# EAGLE design ir sensor (EAGLE 9.6.2)
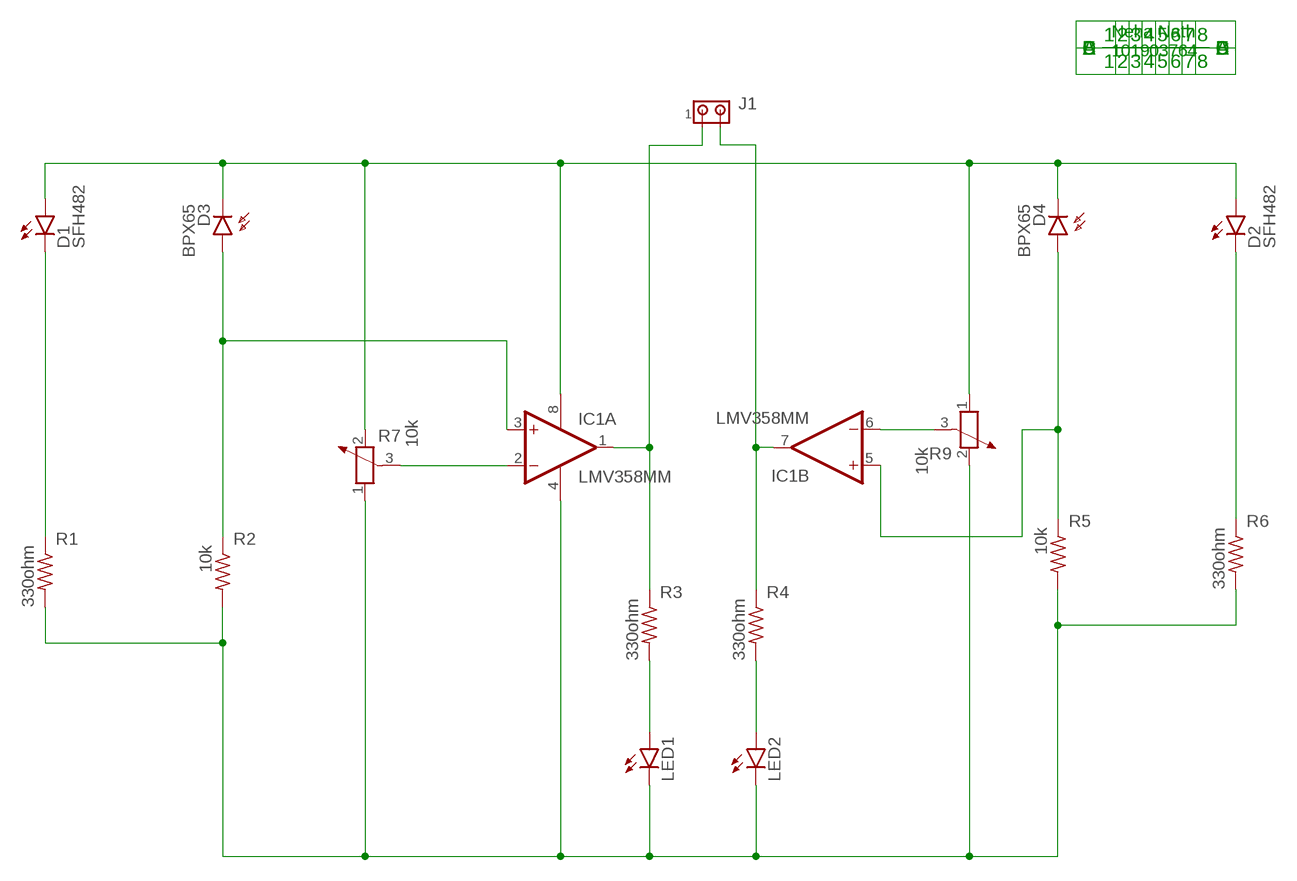
[diagram p0: schematic, sheet 1]

## Parts
D1  SFH482  [SFH482]
D2  SFH482  [SFH482]
D3  BPX65  [BPX65]
D4  BPX65  [BPX65]
IC1  LMV358MM  [MSOP08]
J1  MTA02-100  [10X02MTA]
LED1  LED3MM  [LED3MM]
LED2  LED3MM  [LED3MM]
R1  330ohm  R-US_0207/10  [0207/10]
R2  10k  R-US_0207/10  [0207/10]
R3  330ohm  R-US_0207/10  [0207/10]
R4  330ohm  R-US_0207/10  [0207/10]
R5  10k  R-US_0207/10  [0207/10]
R6  330ohm  R-US_0207/10  [0207/10]
R7  10k  POTENTIOMETER_PT-10S  [PT-10S]
R9  10k  POTENTIOMETER_PT-10S  [PT-10S]

## Nets
N$1: D1.A D2.A D3.K(C) D4.K(C) IC1.8(P:V+) R7.2 R9.1
N$2: D1.K(C) R1.1
N$3: IC1.4(P:V-) LED1.K(C) LED2.K(C) R1.2 R2.2 R5.2 R6.2 R7.1 R9.2
N$4: D3.A IC1.3(A:+IN) R2.1
N$5: IC1.1(A:OUT) J1.1 R3.1
N$6: IC1.7(B:OUT) J1.2 R4.1
N$7: LED1.A R3.2
N$8: LED2.A R4.2
N$9: D4.A IC1.5(B:+IN) R5.1
N$10: D2.K(C) R6.1
N$12: IC1.6(B:-IN) R9.3
N$13: IC1.2(A:-IN) R7.3

## Notes on the sheet
- Neha Nath
  101903764

## Library data of the parts
D1 D2 = led:SFH482: IR LED infrared emitting diode, Infineon
D3 D4 = opto-trans-siemens:BPX65: PHOTO DIODE; MPN: BPX65.; OC_FARNELL: 327451; OC_NEWARK: 06WX2764
IC1 = linear:LMV358?*: Dual General Purpose, Low Voltage, Rail-to-Rail Output Operational Amplifiers Source: http://www.national.com/mpf/LM/LMV321.html http://www.national.com/dt/lmv_qual.pdf
J1 = con-amp:MTA02-100: AMP connector
LED1 LED2 = led:LED: LED OSRAM: - CHIPLED LG R971, LG N971, LY N971, LG Q971, LY Q971, LO R971, LY R971 LH N974, LH R974 LS Q976, LO Q976, LY Q976 LO Q996 - Hyper CHIPLED LW Q18S LB Q993, LB Q99A, LB R99A - SideLED LS A670, LO A670, LY A670, LG A670, LP A670 LB A673, LV A673, LT A673, LW A673 LH A674 LY A675 LS A676, LA A676, LO A676, LY A676, LW A676 LS A679, LY A679, LG A679 - Hyper Micro SIDELED® LS Y876, LA Y876, LO Y876, LY Y876 LT Y87S - SmartLED LW L88C, LW L88S LB L89C, LB L89S, LG L890 LS L89K, LO L89K, LY L89K LS L896, LA L896, LO L896, LY L896 - TOPLED LS T670, LO T670, LY T670, LG T670, LP T670 LSG T670, LSP T670, LSY T670, LOP T670, LYG T670 LG T671, LOG T671, LSG T671 LB T673, LV T673, LT T673, LW T673 LH T674 LS T676, LA T676, LO T676, LY T676, LB T676, LH T676, LSB T676, LW T676 LB T67C, LV T67C, LT T67C, LS T67K, LO T67K, LY T67K, LW E67C LS E67B, LA E67B, LO E67B, LY E67B, LB E67C, LV E67C, LT E67C LW T67C LS T679, LY T679, LG T679 LS T770, LO T770, LY T770, LG T770, LP T770 LB T773, LV T773, LT T773, LW T773 LH T774 LS E675, LA E675, LY E675, LS T675 LS T776, LA T776, LO T776, LY T776, LB T776 LHGB T686 LT T68C, LB T68C - Hyper Mini TOPLED® LB M676 - Mini TOPLED Santana® LG M470 LS M47K, LO M47K, LY M47K Source: http://www.osram.convergy.de LUXEON: - LUMILED® LXK2-PW12-R00, LXK2-PW12-S00, LXK2-PW14-U00, LXK2-PW14-V00 LXK2-PM12-R00, LXK2-PM12-S00, LXK2-PM14-U00 LXK2-PE12-Q00, LXK2-PE12-R00, LXK2-PE12-S00, LXK2-PE14-T00, LXK2-PE14-U00 LXK2-PB12-K00, LXK2-PB12-L00, LXK2-PB12-M00, LXK2-PB14-N00, LXK2-PB14-P00, LXK2-PB14-Q00 LXK2-PR12-L00, LXK2-PR12-M00, LXK2-PR14-Q00, LXK2-PR14-R00 LXK2-PD12-Q00, LXK2-PD12-R00, LXK2-PD12-S00 LXK2-PH12-R00, LXK2-PH12-S00 LXK2-PL12-P00, LXK2-PL12-Q00, LXK2-PL12-R00 Source: www.luxeon.com KINGBRIGHT: KA-3528ASYC Source: www.kingbright.com
R1-R6 = rcl:R-US_: RESISTOR, American symbol; SPICEPREFIX: R
R7 R9 = rcl:POTENTIOMETER_: Potentiometer; SPICEMODEL: POT; SPICEPREFIX: X

## Board
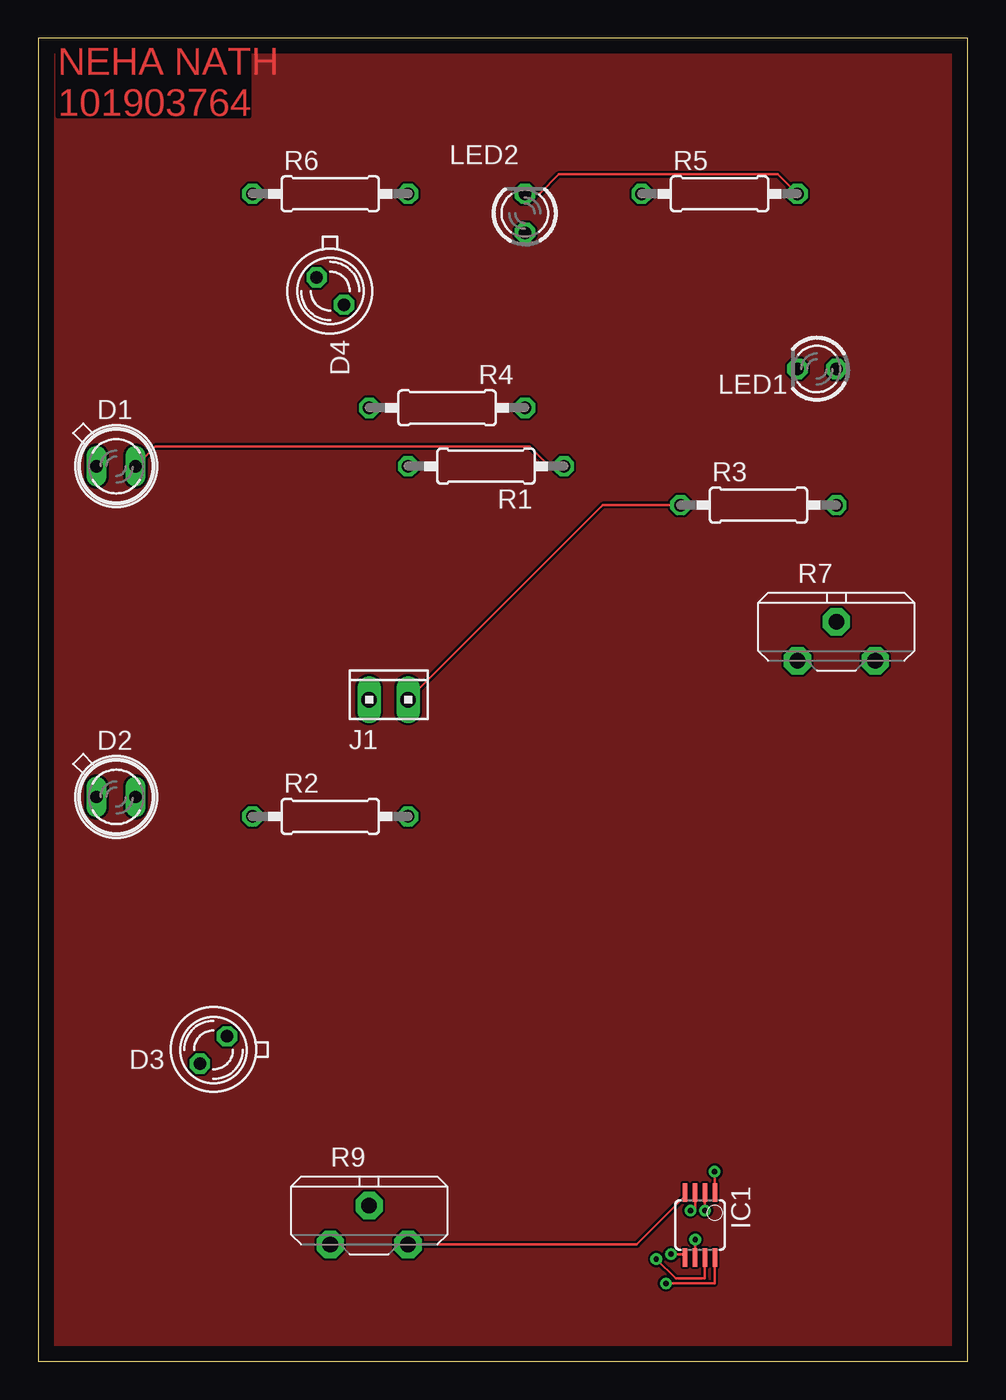
[diagram p1: board, top side]
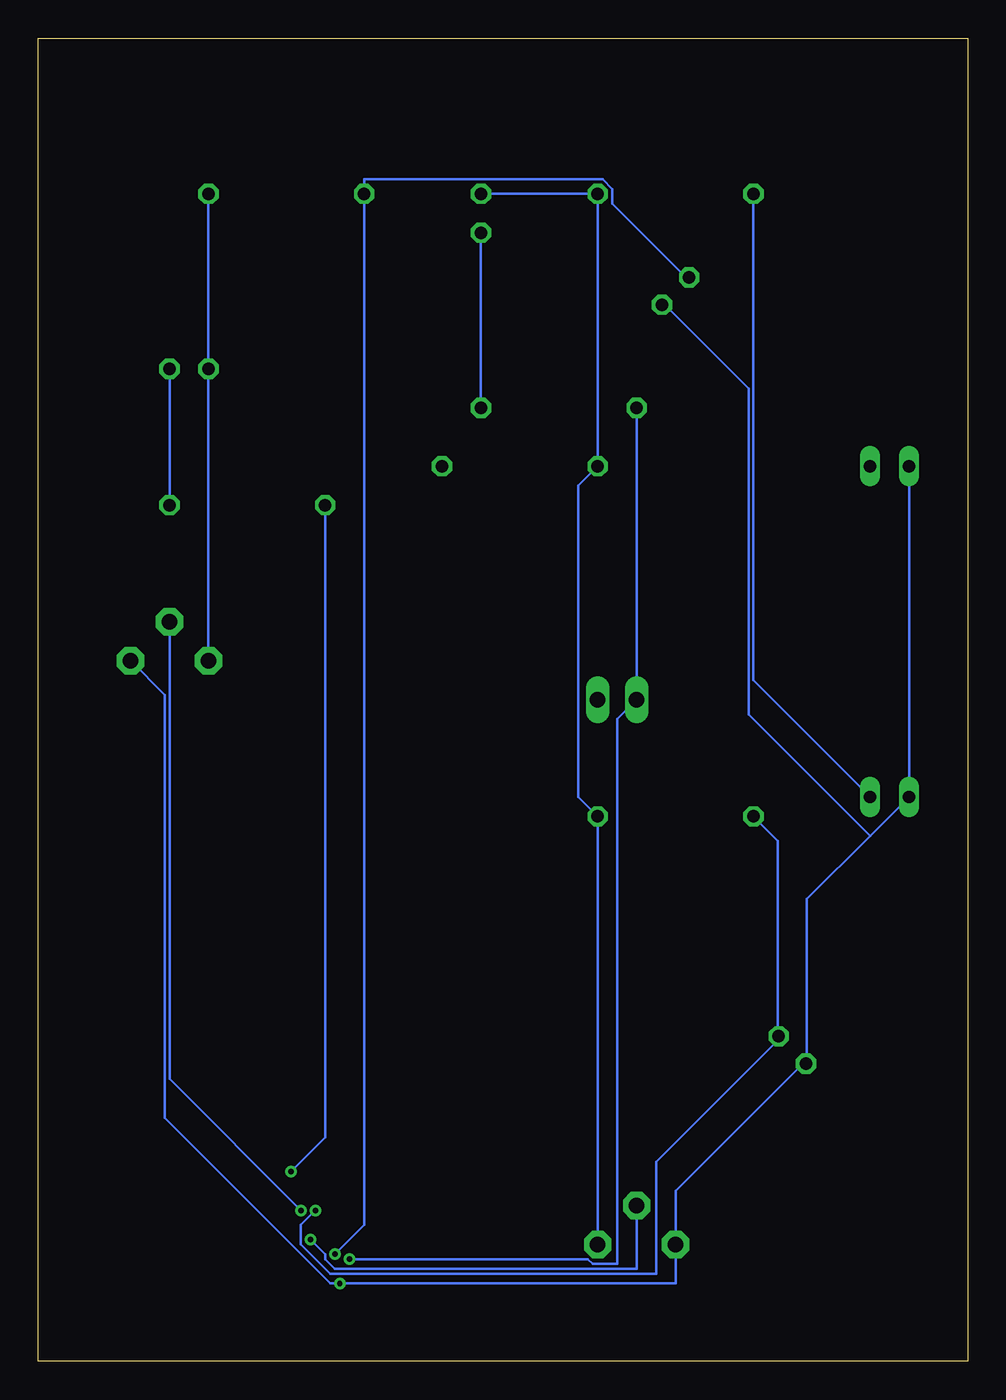
[diagram p2: board, bottom side, seen from below]

Size 60.63 x 86.35 mm. Coordinates in mm from the lower left corner, seen from the top.
Outline: 0,0 60.63,0 60.63,86.35 0,86.35 0,0
Copper layers (1*16): Top 0.035mm / dielectric 1.5mm / Bottom 0.035mm
Design rules "default": minimum track width 6mil, minimum drill 0.35mm, track to track 6mil, track to pad 6mil, pad to pad 6mil, via to via 6mil, smd to smd 6mil, copper to edge 40mil, drill to drill 6mil, minimum pad ring 10mil, minimum via ring 8mil, stop-mask expansion 4mil, vias tented up to drill 0mil, thermal gap 10mil

### Footprints (pad centres in the part's own frame; a part is rotated, then mirrored left to right if it is on the bottom)
SFH482 = drill 0.813 long: A -1.27,0; K 1.27,0
BPX65 = drill 0.813 octagon: A -0.889,-0.889; K 0.889,0.889
MSOP08 = smd 0.3 x 1.2: 1 -0.976,-2.113; 2 -0.326,-2.113; 3 0.324,-2.113; 4 0.974,-2.113; 5 0.974,2.112; 6 0.324,2.112; 7 -0.326,2.112; 8 -0.976,2.112
10X02MTA = drill 1.016 long: 1 1.27,0; 2 -1.27,0
LED3MM = drill 0.813 octagon: A -1.27,0; K 1.27,0
0207/10 = drill 0.813 octagon: 1 -5.08,0; 2 5.08,0
PT-10S = drill 1.016 pad 1.778 octagon: 1 -2.54,-1.27; 2 2.54,-1.27; 3 0,1.27

### Placement (x,y rotation side)
D1  5.08,58.42 0 top
D2  5.08,36.83 0 top
D3  11.43,20.32 180 top
D4  19.05,69.85 270 top
IC1  43.18,8.89 180 top
J1  22.86,43.18 0 top
LED1  50.8,64.77 180 top
LED2  31.75,74.93 90 top
R1  29.21,58.42 180 top
R2  19.05,35.56 0 top
R3  46.99,55.88 0 top
R4  26.67,62.23 0 top
R5  44.45,76.2 0 top
R6  19.05,76.2 0 top
R7  52.07,46.99 0 top
R9  21.59,8.89 0 top

### Tracks (layer width: path | path; a pad name or v marks a point on that pad's centre or on a via)
N$1  (via drill 0.35)
  Top 0.152: v40.96,5.08 44.13,5.08 44.13,6.67 IC1.8
  Bottom 0.152: 6.35,34.29 10.48,30.16 10.48,19.68 D3.K 10.79,19.37 19.05,11.11 R9.1 19.05,5.08 v40.96,5.08 41.59,5.08 52.39,15.88 52.39,43.5 R7.2 | 6.35,34.29 D2.A D1.A | 6.35,34.29 14.29,42.23 14.29,63.5 19.68,68.9 D4.K
N$2
  Top 0.152: D1.K 7.62,59.69 32.07,59.69 33.34,58.42 R1.1
N$3
  Top 0.152: R9.2 39.05,7.62 42.23,10.79 IC1.4 | R5.2 48.26,77.47 33.97,77.47 32.7,76.2 LED2.K
  Bottom 0.152: R5.2 LED1.K R7.1 | LED2.K R6.2 R1.2 25.4,57.15 25.4,36.83 R2.2 R9.2
N$4  (via drill 0.35)
  Top 0.152: v42.55,9.84 42.86,9.84 42.86,10.79 IC1.3
  Bottom 0.152: v42.55,9.84 43.5,8.89 43.5,7.62 41.59,5.71 20.32,5.71 20.32,13.02 12.38,20.95 D3.A 12.38,21.27 12.38,33.97 R2.1
N$5  (via drill 0.35)
  Top 0.152: v44.13,12.38 44.13,11.11 IC1.1 | J1.1 36.83,55.88 R3.1
  Bottom 0.152: v44.13,12.38 41.91,14.61 R3.1
N$6  (via drill 0.35)
  Top 0.152: v40.32,6.67 41.59,5.4 43.5,5.4 43.5,6.67 IC1.7
  Bottom 0.152: v40.32,6.67 24.77,6.67 24.45,6.35 22.86,6.35 22.86,41.91 J1.2 R4.1
N$7
  Bottom 0.152: LED1.A R3.2
N$8
  Bottom 0.152: LED2.A R4.2
N$9  (via drill 0.35)
  Top 0.152: v41.27,6.99 42.23,6.99 IC1.5
  Bottom 0.152: v41.27,6.99 39.37,8.89 R5.1 39.37,77.15 23.81,77.15 23.18,76.52 23.18,75.56 18.41,70.8 D4.A
N$10
  Bottom 0.152: D2.K 13.97,44.45 R6.1
N$11
  pour Top: 0,86.36 60.96,86.36 60.96,0 0,0
N$12  (via drill 0.35)
  Top 0.152: v42.86,7.94 42.86,6.99 IC1.6
  Bottom 0.152: v42.86,7.94 41.91,6.99 41.91,6.67 41.27,6.03 21.59,6.03 R9.3
N$13  (via drill 0.35)
  Top 0.152: v43.5,9.84 43.5,10.79 IC1.2
  Bottom 0.152: v43.5,9.84 52.07,18.41 R7.3

### Text on the board
Top: NEHA NATH / 101903764